# EAGLE design tick-mk-3 (EAGLE 6.5.0)
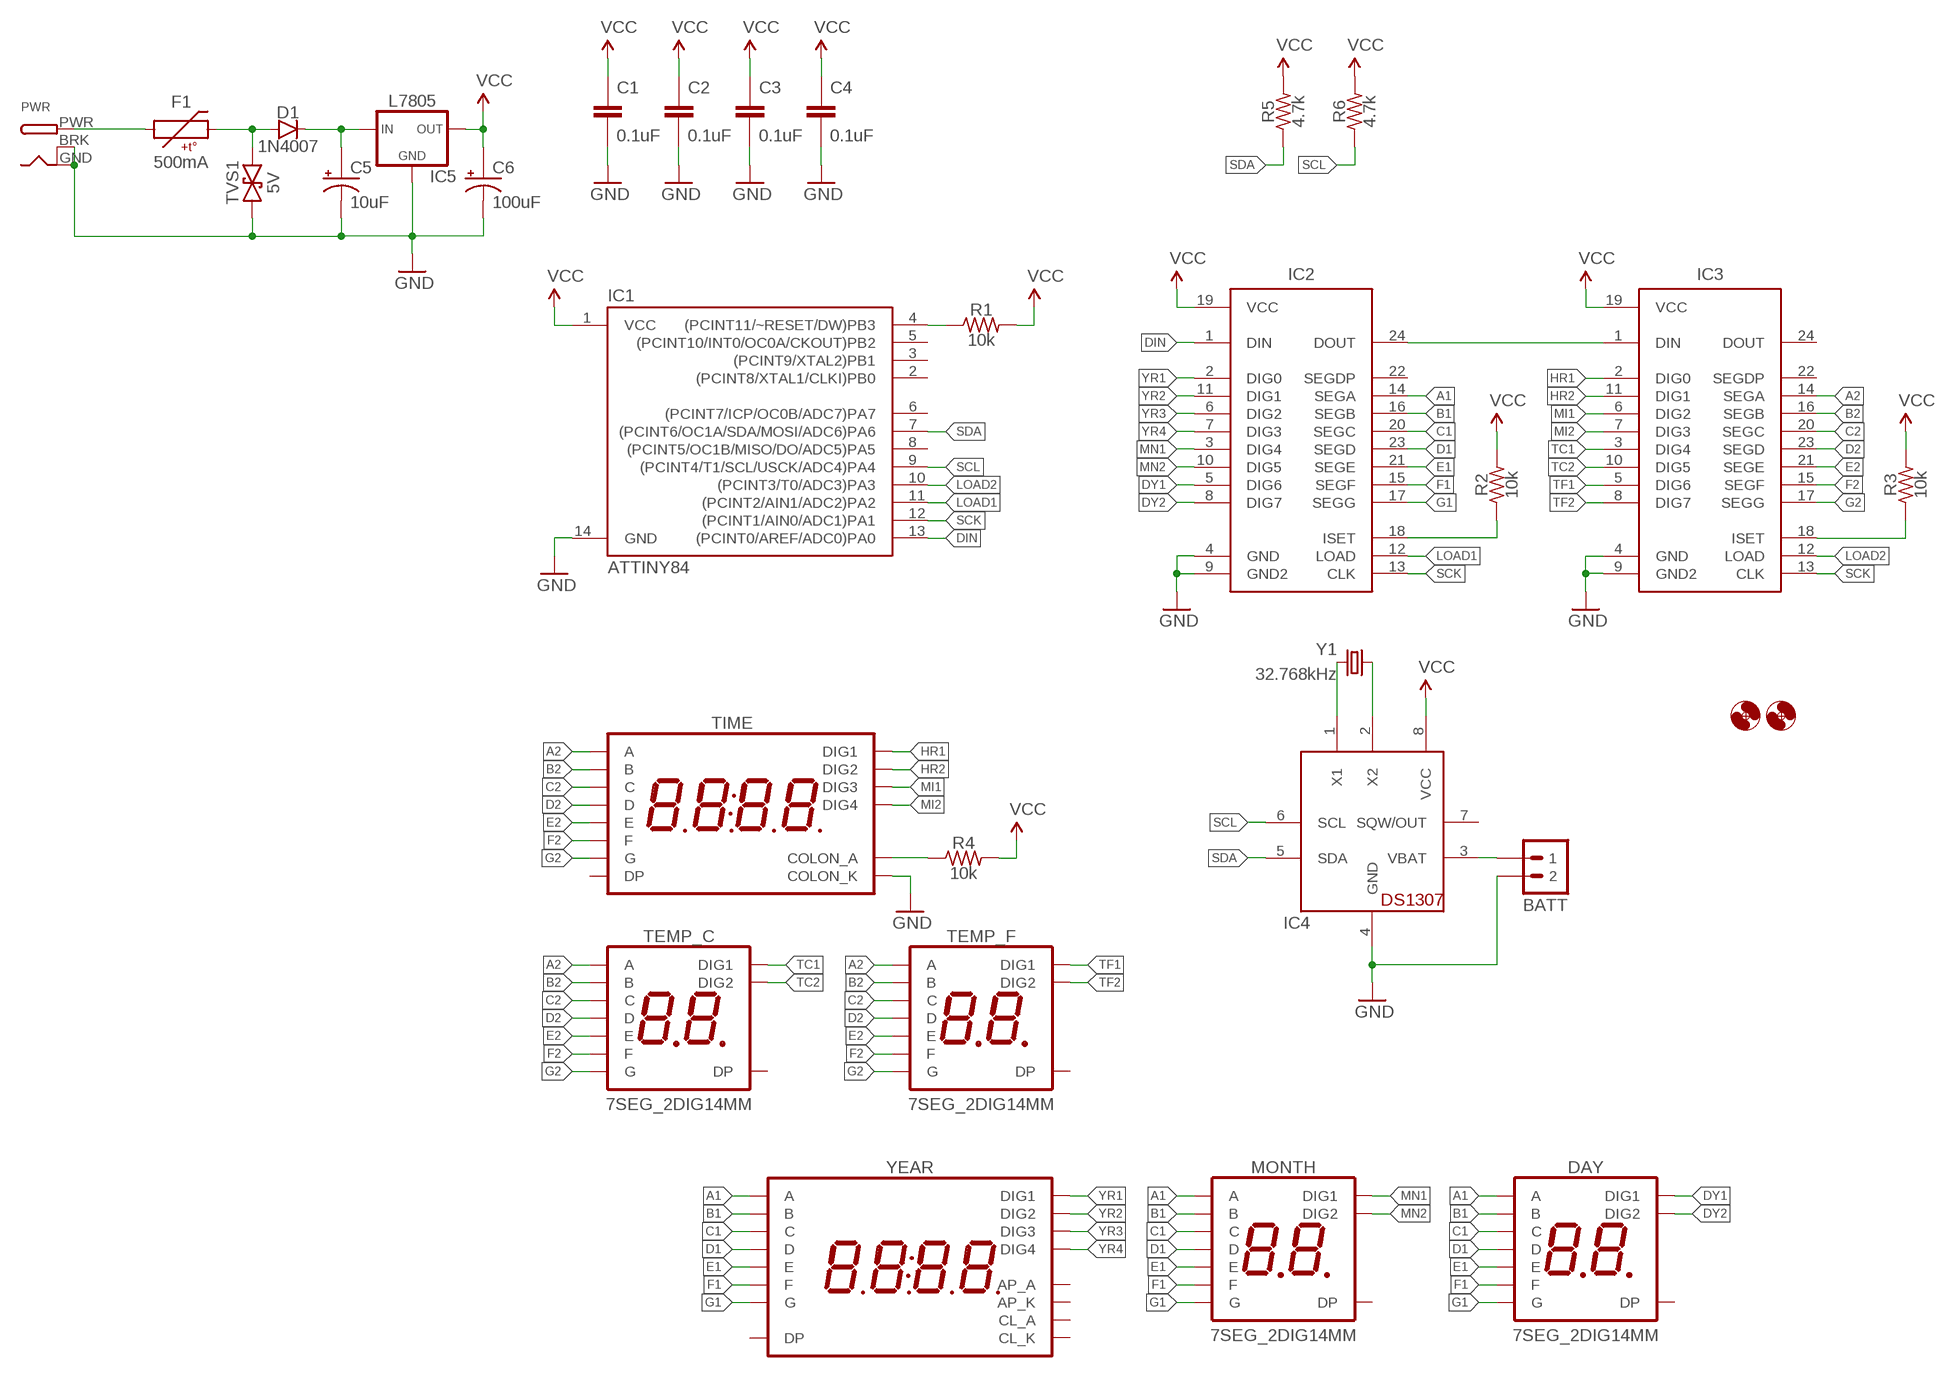
[diagram p0: schematic, sheet 1]

## Parts
BATT  M02JST-PTH-VERT  [JST-2-PH-VERT-PTH]
C1  0.1uF  CAPACITOR-CERAMIC025-024X044  [C025-024X044]
C2  0.1uF  CAPACITOR-CERAMIC025-024X044  [C025-024X044]
C3  0.1uF  CAPACITOR-CERAMIC025-024X044  [C025-024X044]
C4  0.1uF  CAPACITOR-CERAMIC025-024X044  [C025-024X044]
C5  10uF  CAPACITOR-POLARIZEDE2-5  [E2-5]
C6  100uF  CAPACITOR-POLARIZEDE2-5  [E2-5]
D1  1N4007  DIODEPTH-10.68MM  [DIODE-10.16MM]
DAY  7SEG_2DIG14MM  [7SEG_2DIG_14MM]
F1  500mA  PTCPTH-5.08MM  [PTC-PTH-5.08MM]
H1  HOLE#2  [HOLE-#2]
H2  HOLE#2  [HOLE-#2]
IC1  ATTINY84  [SO14]
IC2  MAX7219  MAX7219SOIC-W  [SO24W]
IC3  MAX7219  MAX7219SOIC-W  [SO24W]
IC4  DS1307  [DIL08]
IC5  L7805  V_REG_78XXSIDE  [78XXL]
MONTH  7SEG_2DIG14MM  [7SEG_2DIG_14MM]
PWR  DCBARRELPTH  [DCJACK_2MM_PTH]
R1  10k  RESISTORPTH-AXIAL-5.08MM  [RESISTOR-AXIAL-PTH-5.08MM]
R2  10k  RESISTORPTH-AXIAL-5.08MM  [RESISTOR-AXIAL-PTH-5.08MM]
R3  10k  RESISTORPTH-AXIAL-5.08MM  [RESISTOR-AXIAL-PTH-5.08MM]
R4  10k  RESISTORPTH-AXIAL-5.08MM  [RESISTOR-AXIAL-PTH-5.08MM]
R5  4.7k  RESISTORPTH-AXIAL-5.08MM  [RESISTOR-AXIAL-PTH-5.08MM]
R6  4.7k  RESISTORPTH-AXIAL-5.08MM  [RESISTOR-AXIAL-PTH-5.08MM]
TEMP_C  7SEG_2DIG14MM  [7SEG_2DIG_14MM]
TEMP_F  7SEG_2DIG14MM  [7SEG_2DIG_14MM]
TIME  7SED_4DIGIT_14MM14.2MM-CC  [7SEG_4DIG]
TVS1  5V  TVSDO-41-TVS-BIDIRECTIONAL  [DO-41-TVS]
Y1  32.768kHz  CRYSTALTC26H  [TC26H]
YEAR  7SEG_4DIGIT_10MM  [7SEG_4DIG_10MM]

## Nets
A1: DAY.4(A) IC2.14(SEGA) MONTH.4(A) YEAR.14(A)
A2: IC3.14(SEGA) TEMP_C.4(A) TEMP_F.4(A) TIME.P$13(A)
B1: DAY.3(B) IC2.16(SEGB) MONTH.3(B) YEAR.16(B)
B2: IC3.16(SEGB) TEMP_C.3(B) TEMP_F.3(B) TIME.P$9(B)
C1: DAY.9(C) IC2.20(SEGC) MONTH.9(C) YEAR.13(C)
C2: IC3.20(SEGC) TEMP_C.9(C) TEMP_F.9(C) TIME.P$4(C)
D1: DAY.8(D) IC2.23(SEGD) MONTH.8(D) YEAR.3(D)
D2: IC3.23(SEGD) TEMP_C.8(D) TEMP_F.8(D) TIME.P$2(D)
DIN: IC1.13((PCINT0/AREF/ADC0)PA0) IC2.1(DIN)
DY1: DAY.5(DIG1) IC2.5(DIG6)
DY2: DAY.10(DIG2) IC2.8(DIG7)
E1: DAY.6(E) IC2.21(SEGE) MONTH.6(E) YEAR.5(E)
E2: IC3.21(SEGE) TEMP_C.6(E) TEMP_F.6(E) TIME.P$1(E)
F1: DAY.7(F) IC2.15(SEGF) MONTH.7(F) YEAR.11(F)
F2: IC3.15(SEGF) TEMP_C.7(F) TEMP_F.7(F) TIME.P$12(F)
G1: DAY.1(G) IC2.17(SEGG) MONTH.1(G) YEAR.15(G)
G2: IC3.17(SEGG) TEMP_C.1(G) TEMP_F.1(G) TIME.P$5(G)
GND: BATT.2 C1.2 C2.2 C3.2 C4.2 C5.- C6.- IC1.14(GND) IC2.4(GND) IC2.9(GND2) IC3.4(GND) IC3.9(GND2) IC4.4(GND) IC5.GND PWR.BRK PWR.GND TIME.P$7(COLON_K) TVS1.P$1
HR1: IC3.2(DIG0) TIME.P$14(DIG1)
HR2: IC3.11(DIG1) TIME.P$11(DIG2)
LOAD1: IC1.11((PCINT2/AIN1/ADC2)PA2) IC2.12(LOAD)
LOAD2: IC1.10((PCINT3/T0/ADC3)PA3) IC3.12(LOAD)
MI1: IC3.6(DIG2) TIME.P$10(DIG3)
MI2: IC3.7(DIG3) TIME.P$6(DIG4)
MN1: IC2.3(DIG4) MONTH.5(DIG1)
MN2: IC2.10(DIG5) MONTH.10(DIG2)
N$1: IC1.4((PCINT11/~RESET/DW)PB3) R1.P$1
N$2: IC2.18(ISET) R2.P$1
N$3: IC4.1(X1) Y1.2
N$4: BATT.1 IC4.3(VBAT)
N$5: IC4.2(X2) Y1.1
N$6: C5.+ D1.C IC5.IN
N$7: F1.P$1 PWR.PWR
N$8: D1.A F1.P$2 TVS1.P$2
N$9: IC2.24(DOUT) IC3.1(DIN)
N$10: IC3.18(ISET) R3.P$1
N$18: R4.P$1 TIME.P$8(COLON_A)
SCK: IC1.12((PCINT1/AIN0/ADC1)PA1) IC2.13(CLK) IC3.13(CLK)
SCL: IC1.9((PCINT4/T1/SCL/USCK/ADC4)PA4) IC4.6(SCL) R6.P$1
SDA: IC1.7((PCINT6/OC1A/SDA/MOSI/ADC6)PA6) IC4.5(SDA) R5.P$1
TC1: IC3.3(DIG4) TEMP_C.5(DIG1)
TC2: IC3.10(DIG5) TEMP_C.10(DIG2)
TF1: IC3.5(DIG6) TEMP_F.5(DIG1)
TF2: IC3.8(DIG7) TEMP_F.10(DIG2)
VCC: C1.1 C2.1 C3.1 C4.1 C6.+ IC1.1(VCC) IC2.19(VCC) IC3.19(VCC) IC4.8(VCC) IC5.OUT R1.P$2 R2.P$2 R3.P$2 R4.P$2 R5.P$2 R6.P$2
YR1: IC2.2(DIG0) YEAR.1(DIG1)
YR2: IC2.11(DIG1) YEAR.2(DIG2)
YR3: IC2.6(DIG2) YEAR.6(DIG3)
YR4: IC2.7(DIG3) YEAR.8(DIG4)
Unconnected: DAY.2(DP) IC1.2((PCINT8/XTAL1/CLKI)PB0) IC1.3((PCINT9/XTAL2)PB1) IC1.5((PCINT10/INT0/OC0A/CKOUT)PB2) IC1.6((PCINT7/ICP/OC0B/ADC7)PA7) IC1.8((PCINT5/OC1B/MISO/DO/ADC5)PA5) IC2.22(SEGDP) IC3.22(SEGDP) IC3.24(DOUT) IC4.7(SQW/OUT) MONTH.2(DP) TEMP_C.2(DP) TEMP_F.2(DP) TIME.P$3(DP) YEAR.4(CL_A) YEAR.7(DP) YEAR.9(AP_K) YEAR.10(AP_A) YEAR.12(CL_K)

## Library data of the parts
BATT = A_butts:M02: Standard 2-pin 0.1" header. Use with - straight break away headers ( PRT-00116) - right angle break away headers (PRT-00553) - swiss pins (PRT-00743) - machine pins (PRT-00117) - female headers (PRT-00115) Molex polarized connector foot print use with: PRT-08233 with associated crimp pins and housings. 2.54_SCREWTERM for use with PRT-10571. 3.5mm Screw Terminal footprints for PRT-08084 5mm Screw Terminal footprints for use with PRT-08433
C1-C4 = A_butts:CAPACITOR-CERAMIC: CAPACITOR, European symbol
C5 C6 = A_butts:CAPACITOR-POLARIZED: POLARIZED CAPACITOR, American symbol
D1 = A_butts:DIODE: Diode These are standard reverse protection diodes and small signal diodes. SMA package can handle up to about 1A. SOD-323 can handle about 200mA. What the SOD-323 package when ordering, there are some mfgs out there that are 5-pin packages.
DAY MONTH TEMP_C TEMP_F = A_butts:7SEG_2DIG
F1 = A_butts:PTC: Resettable Fuse PTC Resettable Fuse. Spark Fun Electronics SKU : COM-08357
H1 H2 = A_butts:HOLE: MOUNTING HOLE with drill center marker
IC1 = A_butts:ATTINY84: Atmel 14-pin 2/4/8kB flash uC
IC2 IC3 = A_butts:MAX7219: 8-digit, 8-segment LED display driver, serial input
IC4 = A_butts:DS1307: DS1307 Real time clock (RTC) with battery backup ability. Talk to it via i2c
IC5 = A_butts:V_REG_78XX: Voltage Regulator Standard 7805 5V regulator. IGO (Input Ground Output). Spark Fun Electronics SKU : COM-00107
PWR = A_butts:DCBARREL: 2.0mm DC Barrel Jack DCJACK_2MM_PTH - Through Hole Jack (4UConnector: 05537)
R1-R6 = A_butts:RESISTOR: RESISTOR, American symbol
TIME = A_butts:7SED_4DIGIT_14MM
TVS1 = A_butts:TVS: Transient voltage suppressor- prevents ESD on inputs. Ignore package description- MBRA140 is NOT this type of part!!!
Y1 = A_butts:CRYSTAL: Various standard crystals. Proven footprints. Spark Fun Electronics SKU : COM-00534
YEAR = A_butts:7SEG_4DIGIT_10MM

## Board
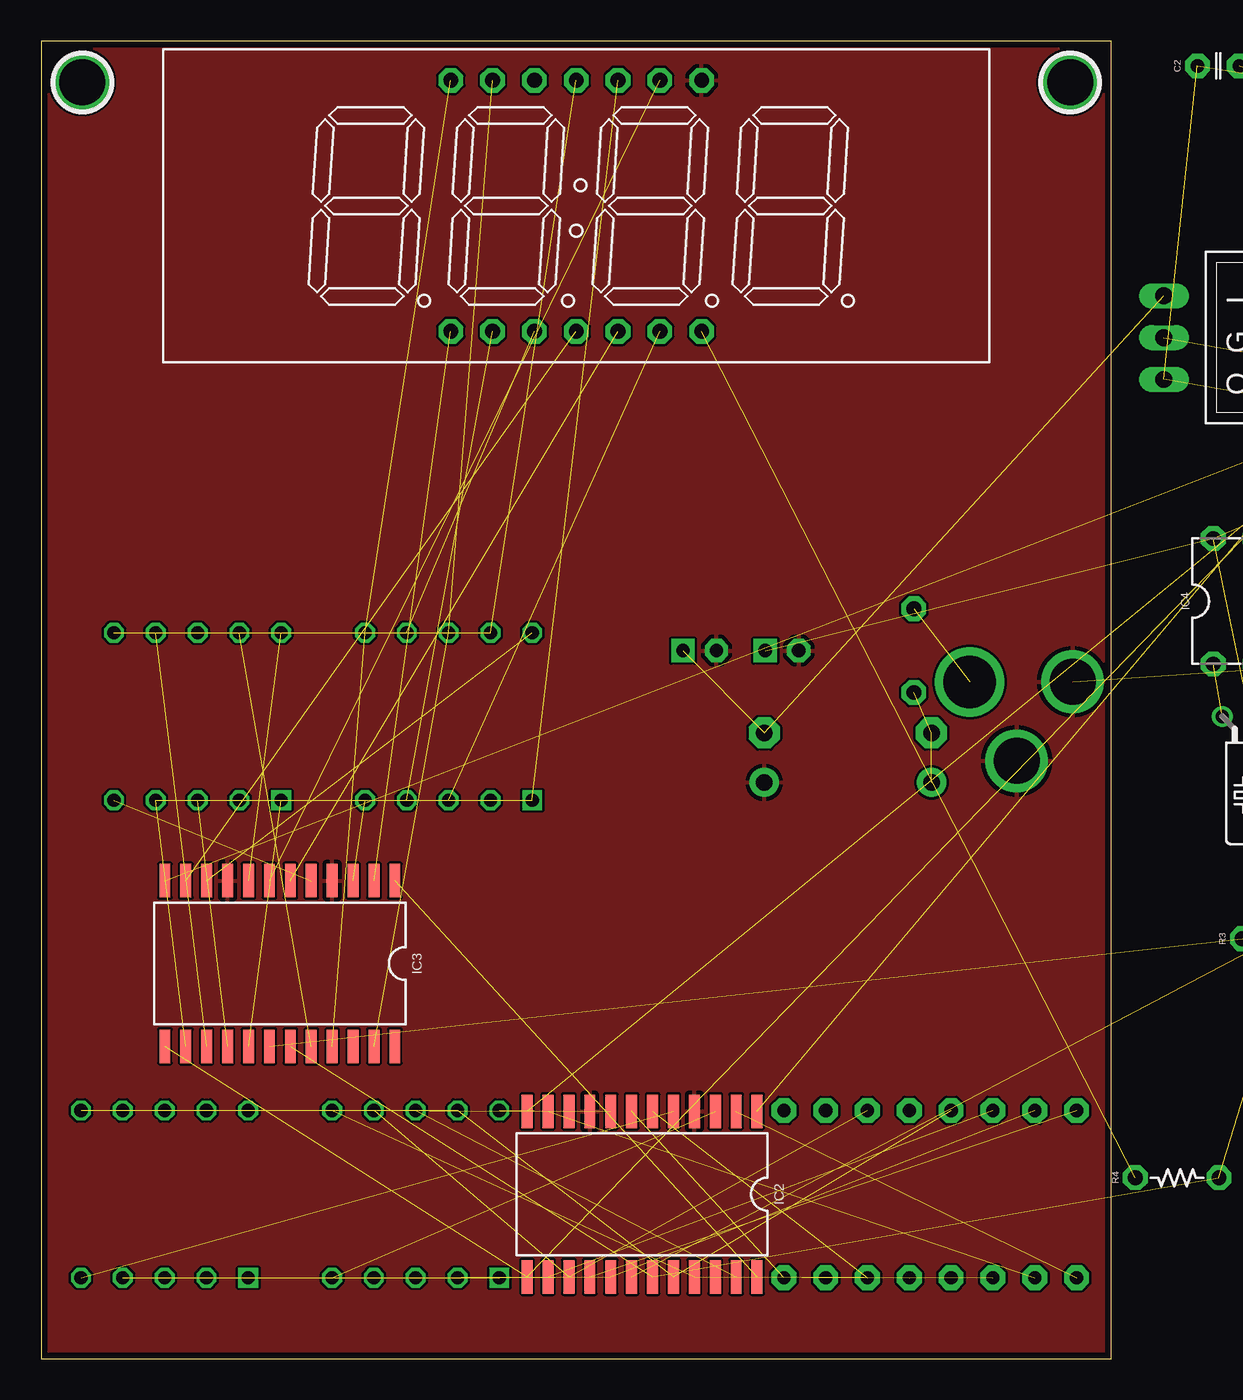
[diagram p1: board, top side]
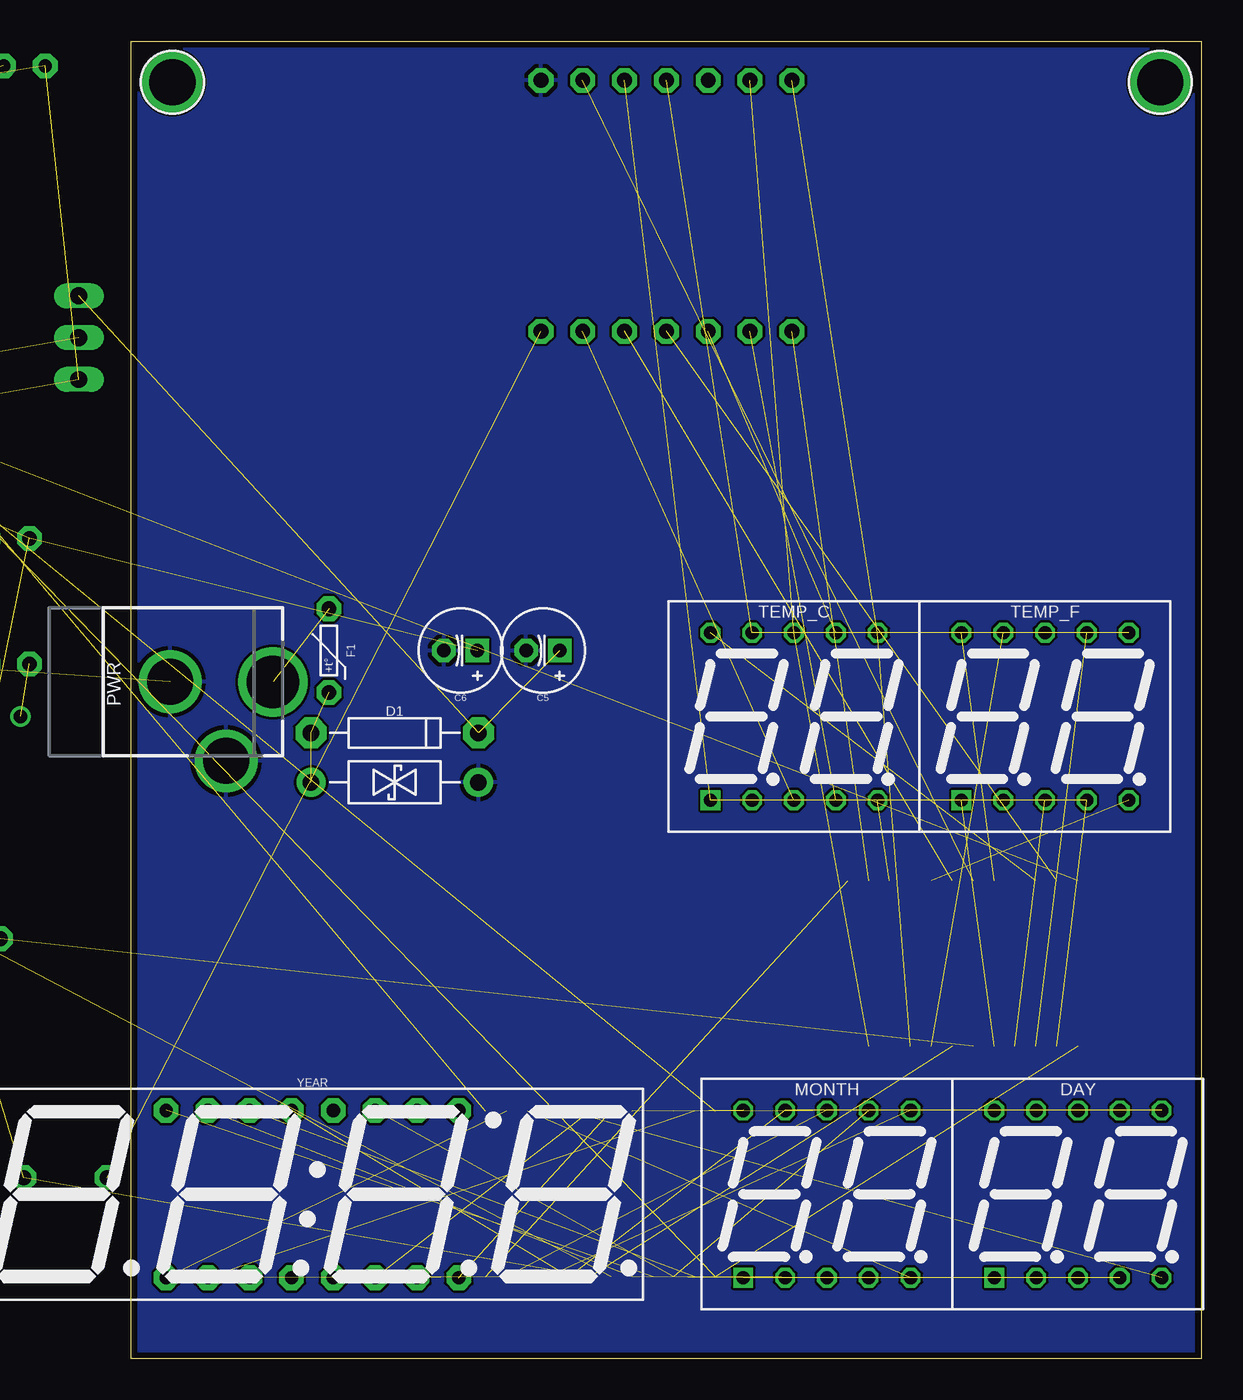
[diagram p2: board, bottom side, seen from below]

Size 65 x 80 mm. Coordinates in mm from the lower left corner, seen from the top.
Outline: 0,0 65,0 65,80 0,80 0,0
Copper layers (1*16): Top 0.0356mm / dielectric 1.5011mm / Bottom 0.0356mm
Design rules "LaenPCBOrder2": minimum track width 6mil, minimum drill 13mil, track to track 6mil, track to pad 6mil, pad to pad 6mil, via to via 6mil, smd to smd 6mil, copper to edge 15mil, drill to drill 6mil, minimum pad ring 7mil, minimum via ring 7mil, stop-mask expansion 3mil, vias tented up to drill 20mil, thermal gap 10mil

### Footprints (pad centres in the part's own frame; a part is rotated, then mirrored left to right if it is on the bottom)
JST-2-PH-VERT-PTH = drill 0.9 octagon: 1 -1,0; 2 1,0
C025-024X044 = drill 0.813 pad 1.5 octagon: 1 -1.27,0; 2 1.27,0
E2-5 = drill 0.813 pad 1.422 square: + -1.016,0 | drill 0.813 pad 1.422 octagon: - 1.016,0
DIODE-10.16MM = drill 1 pad 1.88 octagon: A -5.08,0; C 5.08,0
7SEG_2DIG_14MM = drill 0.8 square: 1 -5.08,-5.08 | drill 0.8 octagon: 2 -2.54,-5.08; 3 0,-5.08; 4 2.54,-5.08; 5 5.08,-5.08; 6 5.08,5.08; 7 2.54,5.08; 8 0,5.08; 9 -2.54,5.08; 10 -5.08,5.08
PTC-PTH-5.08MM = drill 0.9 pad 1.5 octagon: P$1 -2.54,0; P$2 2.54,0
HOLE-#2 = drill 2.8 pad 3.81: P$1 0,0
SO14 = smd 0.6 x 1.2: 1 -3.81,-2.8; 2 -2.54,-2.8; 3 -1.27,-2.8; 4 0,-2.8; 5 1.27,-2.8; 6 2.54,-2.8; 7 3.81,-2.8; 8 3.81,2.8; 9 2.54,2.8; 10 1.27,2.8; 11 0,2.8; 12 -1.27,2.8; 13 -2.54,2.8; 14 -3.81,2.8
SO24W = smd 0.66 x 2.032: 1 -6.985,-5.029; 2 -5.715,-5.029; 3 -4.445,-5.029; 4 -3.175,-5.029; 5 -1.905,-5.029; 6 -0.635,-5.029; 7 0.635,-5.029; 8 1.905,-5.029; 9 3.175,-5.029; 10 4.445,-5.029; 11 5.715,-5.029; 12 6.985,-5.029; 13 6.985,5.029; 14 5.715,5.029; 15 4.445,5.029; 16 3.175,5.029; 17 1.905,5.029; 18 0.635,5.029; 19 -0.635,5.029; 20 -1.905,5.029; 21 -3.175,5.029; 22 -4.445,5.029; 23 -5.715,5.029; 24 -6.985,5.029
DIL08 = drill 0.9 pad 1.5 octagon: 1 -3.81,-3.81; 2 -1.27,-3.81; 3 1.27,-3.81; 4 3.81,-3.81; 5 3.81,3.81; 6 1.27,3.81; 7 -1.27,3.81; 8 -3.81,3.81
78XXL = drill 1.016 long: GND 0,-3.81; IN -2.54,-3.81; OUT 2.54,-3.81
DCJACK_2MM_PTH = drill 2.8: BRK 4.8,10.75; GND 0,7.35 | drill 3.2: PWR 0,13.6
RESISTOR-AXIAL-PTH-5.08MM = drill 0.9 pad 1.5 octagon: P$1 -2.54,0; P$2 2.54,0
7SEG_4DIG = drill 0.9 pad 1.5 octagon: P$1 -7.62,7.62; P$2 -5.08,7.62; P$3 -2.54,7.62; P$4 0,7.62; P$5 2.54,7.62; P$6 5.08,7.62; P$7 7.62,7.62; P$8 7.62,-7.62; P$9 5.08,-7.62; P$10 2.54,-7.62; P$11 0,-7.62; P$12 -2.54,-7.62; P$13 -5.08,-7.62; P$14 -7.62,-7.62
DO-41-TVS = drill 1 pad 1.778: P$1 -5.08,0; P$2 5.08,0
TC26H = drill 0.8 pad 1.27: 1 -1.27,0; 2 1.27,0
7SEG_4DIG_10MM = drill 0.8 pad 1.5 octagon: 1 -8.89,-5.08; 2 -6.35,-5.08; 3 -3.81,-5.08; 4 -1.27,-5.08; 5 1.27,-5.08; 6 3.81,-5.08; 7 6.35,-5.08; 8 8.89,-5.08; 9 8.89,5.08; 10 6.35,5.08; 11 3.81,5.08; 12 1.27,5.08; 13 -1.27,5.08; 14 -3.81,5.08; 15 -6.35,5.08; 16 -8.89,5.08

### Placement (x,y rotation side)
BATT  88,40 270 top  (outside the outline)
C1  78,59 90 top  (outside the outline)
C2  71.5,78.5 0 top  (outside the outline)
C3  78.5,77 180 top  (outside the outline)
C4  94,72 0 top  (outside the outline)
C5  40,43 180 bottom
C6  45,43 180 bottom
D1  49,38 0 bottom
DAY  7.5,10 0 bottom
F1  53,43 270 bottom
H1  2.5,77.5 0 top
H2  62.5,77.5 0 top
IC1  83,56 0 top  (outside the outline)
IC2  36.5,10 180 top
IC3  14.5,24 180 top
IC4  75,46 0 top  (outside the outline)
IC5  72,62 270 top  (outside the outline)
MONTH  22.75,10 0 bottom
PWR  70,41.1 270 bottom
R1  77.74,23.04 180 top  (outside the outline)
R2  77,28 180 top  (outside the outline)
R3  75.5,25.5 0 top  (outside the outline)
R4  69,11 0 top
R5  77,34 180 top  (outside the outline)
R6  77,31 0 top  (outside the outline)
TEMP_C  24.75,39 0 bottom
TEMP_F  9.5,39 0 bottom
TIME  32.5,70 0 top
TVS1  49,35 180 bottom
Y1  73,39 180 top  (outside the outline)
YEAR  54,10 0 bottom

### Tracks (layer width: path | path; a pad name or v marks a point on that pad's centre or on a via)
A1  (3 unrouted)
A2  (3 unrouted)
B1  (3 unrouted)
B2  (3 unrouted)
C1  (3 unrouted)
C2  (3 unrouted)
D1  (3 unrouted)
D2  (3 unrouted)
DIN  (1 unrouted)
DY1  (1 unrouted)
DY2  (1 unrouted)
E1  (3 unrouted)
E2  (3 unrouted)
F1  (3 unrouted)
F2  (3 unrouted)
G1  (3 unrouted)
G2  (3 unrouted)
GND  (8 unrouted)
  pour Top: 0,0 0,80 65,80 65,0
  pour Bottom: 0,0 0,80 65,80 65,0
HR1  (1 unrouted)
HR2  (1 unrouted)
LOAD1  (1 unrouted)
LOAD2  (1 unrouted)
MI1  (1 unrouted)
MI2  (1 unrouted)
MN1  (1 unrouted)
MN2  (1 unrouted)
N$1  (1 unrouted)
N$2  (1 unrouted)
N$3  (1 unrouted)
N$4  (1 unrouted)
N$5  (1 unrouted)
N$6  (2 unrouted)
N$7  (1 unrouted)
N$8  (2 unrouted)
N$9  (1 unrouted)
N$10  (1 unrouted)
N$18  (1 unrouted)
SCK  (2 unrouted)
SCL  (2 unrouted)
SDA  (2 unrouted)
TC1  (1 unrouted)
TC2  (1 unrouted)
TF1  (1 unrouted)
TF2  (1 unrouted)
VCC  (15 unrouted)
YR1  (1 unrouted)
YR2  (1 unrouted)
YR3  (1 unrouted)
YR4  (1 unrouted)